# Altium schematic sheet 海关全向控制器主控板电路V4_系统管理.SchDoc
size A4
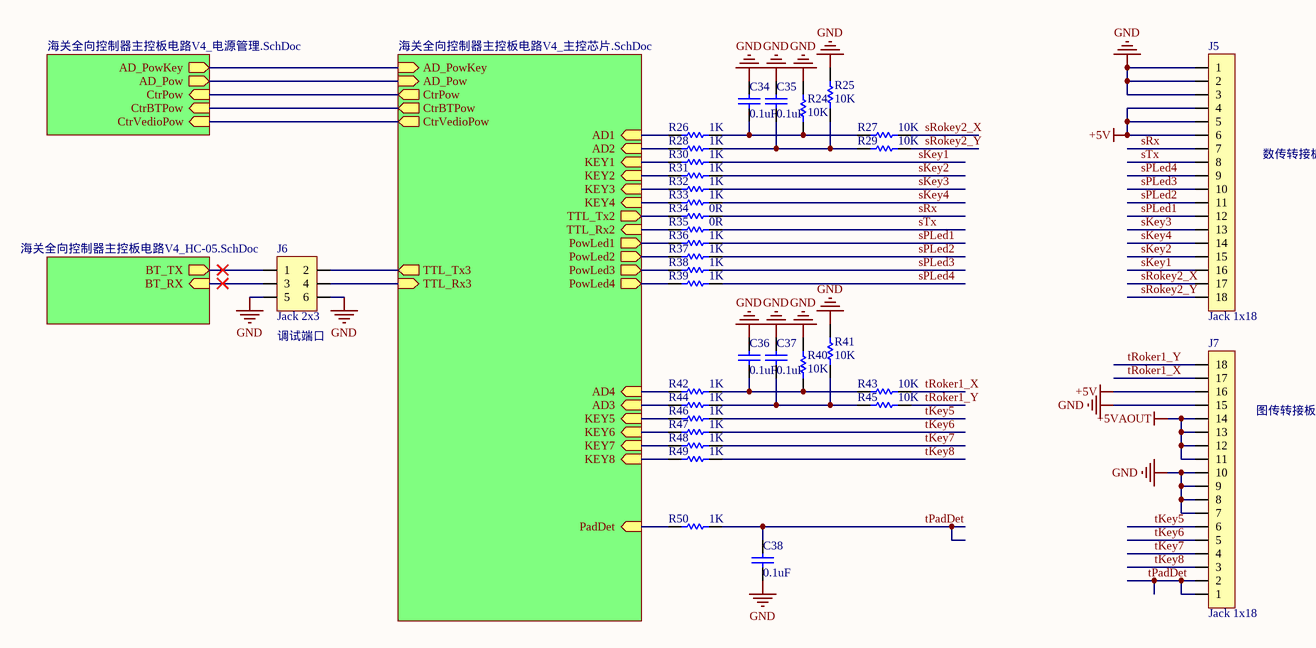
[diagram p0: 海关全向控制器主控板电路V4_系统管理.SchDoc]

## Parts
C34  0.1uF  [C0805]
C35  0.1uF  [C0805]
C36  0.1uF  [C0805]
C37  0.1uF  [C0805]
C38  0.1uF  [C0805]
J5  Jack 1x18  [0.5S-6X-18PB]
J6  Jack 2x3  [Jk2*3-2.0]
J7  Jack 1x18  [0.5S-6X-18PB]
R24  10K  [R0805]
R25  10K  [R0805]
R26  1K  [R0805]
R27  10K  [R0805]
R28  1K  [R0805]
R29  10K  [R0805]
R30  1K  [R0805]
R31  1K  [R0805]
R32  1K  [R0805]
R33  1K  [R0805]
R34  0R  [R0805]
R35  0R  [R0805]
R36  1K  [R0805]
R37  1K  [R0805]
R38  1K  [R0805]
R39  1K  [R0805]
R40  10K  [R0805]
R41  10K  [R0805]
R42  1K  [R0805]
R43  10K  [R0805]
R44  1K  [R0805]
R45  10K  [R0805]
R46  1K  [R0805]
R47  1K  [R0805]
R48  1K  [R0805]
R49  1K  [R0805]
R50  1K  [R0805]

## Sub-sheets
Designator = 海关全向控制器主控板电路V4_电源管理.SchDoc: AD_PowKey (out), AD_Pow (out), CtrPow (in), CtrBTPow (in), CtrVedioPow (in)
Designator = 海关全向控制器主控板电路V4_主控芯片.SchDoc: AD_PowKey (in), AD_Pow (in), CtrPow (out), TTL_Rx2 (in), TTL_Tx2 (out), AD1 (in), AD2 (in), AD3 (in), AD4 (in), TTL_Tx3 (out), TTL_Rx3 (in), PadDet (in), CtrBTPow (out), KEY1 (in), KEY2 (in), KEY3 (in), KEY4 (in), PowLed1 (out), PowLed2 (out), PowLed3 (out), PowLed4 (out), KEY5 (in), KEY6 (in), KEY7 (in), KEY8 (in), CtrVedioPow (out)
Designator = 海关全向控制器主控板电路V4_HC-05.SchDoc: BT_RX (in), BT_TX (out)

## Nets
+5V: J5.4 J5.5 J5.6 J7.16
+5VAOUT: J7.11 J7.12 J7.13 J7.14
GND: C34.2 C35.2 C36.2 C37.2 C38.1 J5.1 J5.2 J5.3 J6.5 J6.6 J7.7 J7.8 J7.9 J7.10 J7.15 R24.1 R25.1 R40.1 R41.1
sKey1: J5.16 R30.1
sKey2: J5.15 R31.1
sKey3: J5.13 R32.1
sKey4: J5.14 R33.1
sPLed1: J5.12 R36.1
sPLed2: J5.11 R37.1
sPLed3: J5.10 R38.1
sPLed4: J5.9 R39.1
sRokey2_X: J5.17 R27.1
sRokey2_Y: J5.18 R29.1
sRx: J5.7 R34.1
sTx: J5.8 R35.1
tKey5: J7.6 R46.1
tKey6: J7.5 R47.1
tKey7: J7.4 R48.1
tKey8: J7.3 R49.1
tPadDet: C38.2 J7.1 J7.2 R50.1
tRoker1_X: J7.17 R43.1
tRoker1_Y: J7.18 R45.1
NetC34_1: C34.1 R24.2 R26.1 R27.2
NetC35_1: C35.1 R25.2 R28.1 R29.2
NetC36_1: C36.1 R40.2 R42.1 R43.2
NetC37_1: C37.1 R41.2 R44.1 R45.2
NetJ6_1: J6.1 ; sheet Designator/BT_TX
NetJ6_2: J6.2 ; sheet Designator/TTL_Tx3
NetJ6_3: J6.3 ; sheet Designator/BT_RX
NetJ6_4: J6.4 ; sheet Designator/TTL_Rx3
NetR26_2: R26.2 ; sheet Designator/AD1
NetR28_2: R28.2 ; sheet Designator/AD2
NetR30_2: R30.2 ; sheet Designator/KEY1
NetR31_2: R31.2 ; sheet Designator/KEY2
NetR32_2: R32.2 ; sheet Designator/KEY3
NetR33_2: R33.2 ; sheet Designator/KEY4
NetR34_2: R34.2 ; sheet Designator/TTL_Tx2
NetR35_2: R35.2 ; sheet Designator/TTL_Rx2
NetR36_2: R36.2 ; sheet Designator/PowLed1
NetR37_2: R37.2 ; sheet Designator/PowLed2
NetR38_2: R38.2 ; sheet Designator/PowLed3
NetR39_2: R39.2 ; sheet Designator/PowLed4
NetR42_2: R42.2 ; sheet Designator/AD4
NetR44_2: R44.2 ; sheet Designator/AD3
NetR46_2: R46.2 ; sheet Designator/KEY5
NetR47_2: R47.2 ; sheet Designator/KEY6
NetR48_2: R48.2 ; sheet Designator/KEY7
NetR49_2: R49.2 ; sheet Designator/KEY8
NetR50_2: R50.2 ; sheet Designator/PadDet
(unnamed): sheet Designator/AD_PowKey, sheet Designator/AD_PowKey
(unnamed): sheet Designator/AD_Pow, sheet Designator/AD_Pow
(unnamed): sheet Designator/CtrPow, sheet Designator/CtrPow
(unnamed): sheet Designator/CtrBTPow, sheet Designator/CtrBTPow
(unnamed): sheet Designator/CtrVedioPow, sheet Designator/CtrVedioPow

## Notes on the sheet
- 数传转接板
- (near J6) 调试端口
- (near J7) 图传转接板
- 文件名:
- 审核:
- 制图人:
- 孟浩
- 校对:
- 图号:
- 批准:
- 日期:

## Library data of the parts
C34-C38 = Cap: Capacitor; Published: 8-Jun-2000; Revision: July-2002: Re-released for DXP Platform.; Publisher: Altium Limited
J5 J7 = Jack 1x18: 插座
J6 = Jack 2x3: 双排座
R24-R50 = Res